# Altium schematic sheet modFOC-MCU.SchDoc
size A4
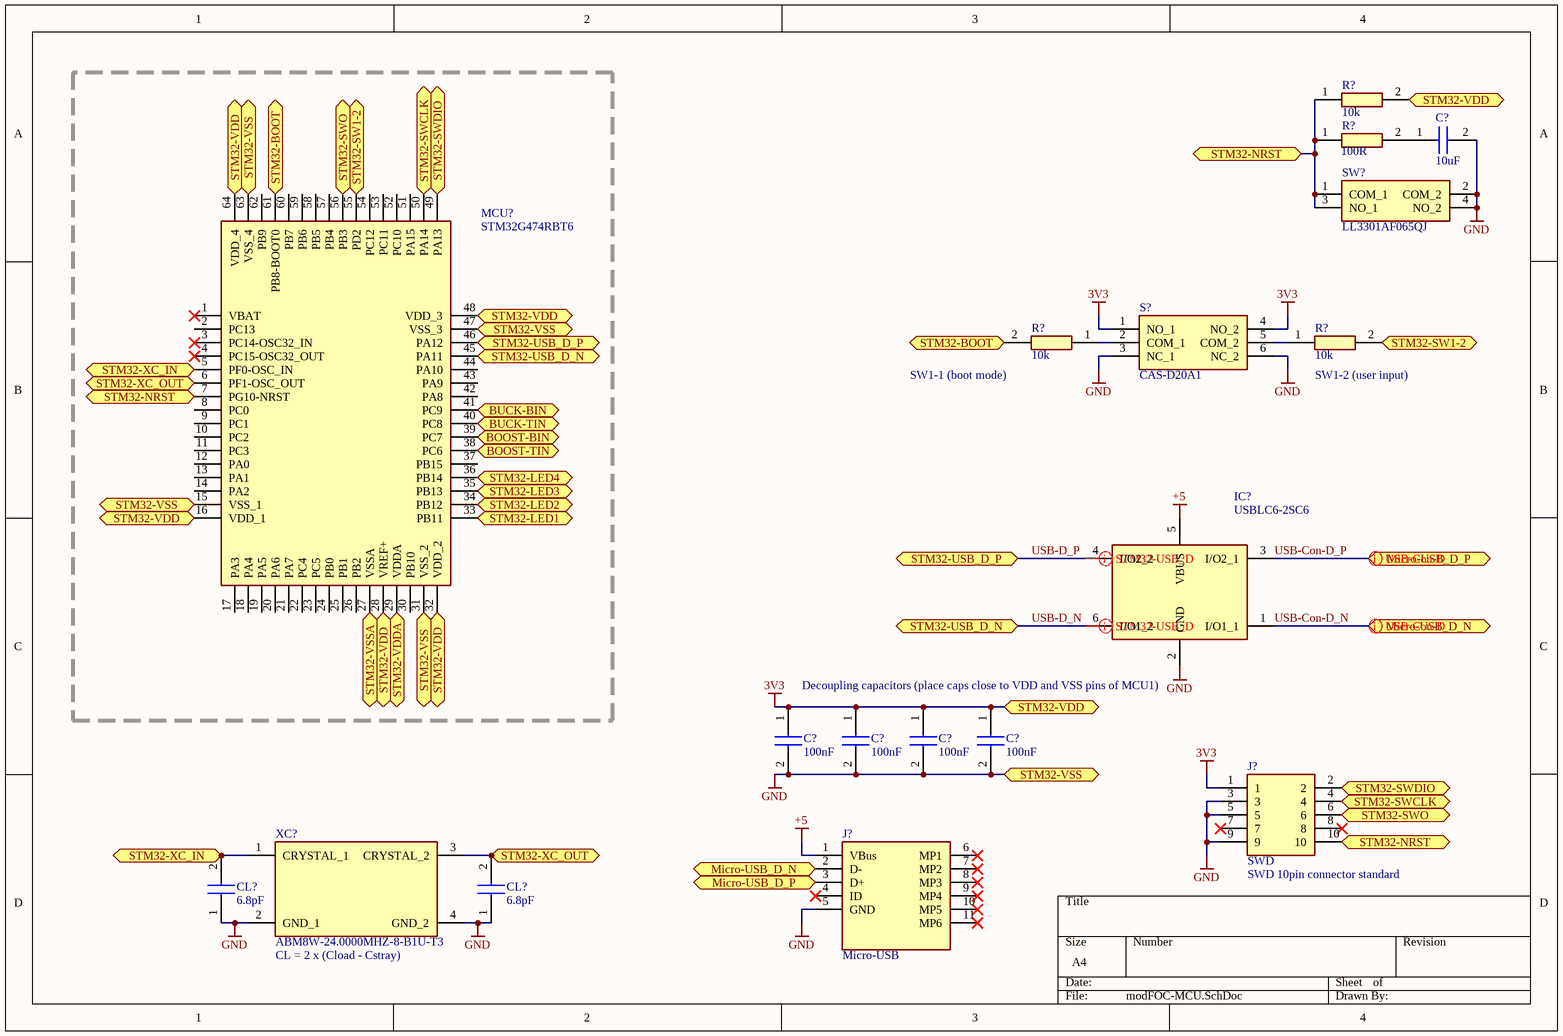
[diagram p0: modFOC-MCU.SchDoc]

## Parts
(Parts that share a designator on the sheet are numbered #1, #2 ... from top to bottom, then left to right.)
C?#1  10uF  [CAPC3225X280N]
C?#2  100nF  [CAPC1608X97N]
C?#3  100nF  [CAPC1608X97N]
C?#4  100nF  [CAPC1608X97N]
C?#5  100nF  [CAPC1608X97N]
CL?#1  6.8pF  [CAPC1608X87N]
CL?#2  6.8pF  [CAPC1608X87N]
IC?  USBLC6-2SC6  [SOT95P280X145-6N]
J?#1  SWD  [HUSSP10W40P127_2X5_635X340X420P]
J?#2  Micro-USB  [19815841]
MCU?  STM32G474RBT6  [QFP50P1200X1200X160-64N]
R?#1  10k  [RESC1608X55N]
R?#2  100R  [RESC1608X55N]
R?#3  10k  [RESC1608X55N]
R?#4  10k  [RESC1608X55N]
S?  CAS-D20A1  [CASD20A1]
SW?  LL3301AF065QJ  [LL3301FF065QJ]
XC?  ABM8W-24.0000MHZ-8-B1U-T3  [ABM8W240000MHZ8B1UT3]

## Ports
BOOST-BIN (bidir), BOOST-TIN (bidir), BUCK-BIN (bidir), BUCK-TIN (bidir), Micro-USB_D_N (bidir), Micro-USB_D_P (bidir), STM32-BOOT (bidir), STM32-LED1 (bidir), STM32-LED2 (bidir), STM32-LED3 (bidir), STM32-LED4 (bidir), STM32-NRST (bidir), STM32-SW1-2 (bidir), STM32-SWCLK (bidir), STM32-SWDIO (bidir), STM32-SWO (bidir), STM32-USB_D_N (bidir), STM32-USB_D_P (bidir), STM32-VDD (bidir), STM32-VDDA (bidir), STM32-VSS (bidir), STM32-VSSA (bidir), STM32-XC_IN (bidir), STM32-XC_OUT (bidir)

## Nets
3V3: C?#2.1 C?#3.1 C?#4.1 C?#5.1 J?#1.1 MCU?.16(VDD_1) MCU?.28(VREF+) MCU?.32(VDD_2) MCU?.48(VDD_3) MCU?.64(VDD_4) R?#1.2 S?.1(NO_1) S?.4(NO_2) ; port STM32-VDD
+5: IC?.5(VBUS) J?#2.1(VBus)
GND: C?#1.2 C?#2.2 C?#3.2 C?#4.2 C?#5.2 CL?#1.1 CL?#2.1 IC?.2(GND) J?#1.3 J?#1.5 J?#1.9 J?#2.5(GND) MCU?.15(VSS_1) MCU?.31(VSS_2) MCU?.47(VSS_3) MCU?.63(VSS_4) S?.3(NC_1) S?.6(NC_2) SW?.2(COM_2) SW?.4(NO_2) XC?.2(GND_1) XC?.4(GND_2) ; port STM32-VSS
BOOST-BIN: MCU?.39(PC7) ; port BOOST-BIN
BOOST-TIN: MCU?.38(PC6) ; port BOOST-TIN
BUCK-BIN: MCU?.41(PC9) ; port BUCK-BIN
BUCK-TIN: MCU?.40(PC8) ; port BUCK-TIN
STM32-BOOT: MCU?.61(PB8-BOOT0) R?#3.2 ; port STM32-BOOT
STM32-LED1: MCU?.33(PB11) ; port STM32-LED1
STM32-LED2: MCU?.34(PB12) ; port STM32-LED2
STM32-LED3: MCU?.35(PB13) ; port STM32-LED3
STM32-LED4: MCU?.36(PB14) ; port STM32-LED4
STM32-NRST: J?#1.10 MCU?.7(PG10-NRST) R?#1.1 R?#2.1 SW?.1(COM_1) SW?.3(NO_1) ; port STM32-NRST
STM32-SW1-2: MCU?.55(PD2) R?#4.2 ; port STM32-SW1-2
STM32-SWCLK: J?#1.4 MCU?.50(PA14) ; port STM32-SWCLK
STM32-SWDIO: J?#1.2 MCU?.49(PA13) ; port STM32-SWDIO
STM32-SWO: J?#1.6 MCU?.56(PB3) ; port STM32-SWO
STM32-VDDA: MCU?.29(VDDA) ; port STM32-VDDA
STM32-VSSA: MCU?.27(VSSA) ; port STM32-VSSA
STM32-XC_IN: CL?#1.2 MCU?.5(PF0-OSC_IN) XC?.1(CRYSTAL_1) ; port STM32-XC_IN
STM32-XC_OUT: CL?#2.2 MCU?.6(PF1-OSC_OUT) XC?.3(CRYSTAL_2) ; port STM32-XC_OUT
USB-Con-D_N: IC?.1(I/O1_1) J?#2.2(D-) ; port Micro-USB_D_N
USB-Con-D_P: IC?.3(I/O2_1) J?#2.3(D+) ; port Micro-USB_D_P
USB-D_N: IC?.6(I/O1_2) MCU?.45(PA11) ; port STM32-USB_D_N
USB-D_P: IC?.4(I/O2_2) MCU?.46(PA12) ; port STM32-USB_D_P
NetC?#1_1: C?#1.1 R?#2.2
NetR?#3_1: R?#3.1 S?.2(COM_1)
NetR?#4_1: R?#4.1 S?.5(COM_2)

Not connected (* = marked no-connect by the designer): J?#1 7* 8*; J?#2 4(ID)* 6(MP1)* 7(MP2)* 8(MP3)* 9(MP4)* 10(MP5)* 11(MP6)*; MCU? 1(VBAT)* 2(PC13) 3(PC14-OSC32_IN)* 4(PC15-OSC32_OUT)* 8(PC0) 9(PC1) 10(PC2) 11(PC3) 12(PA0) 13(PA1) 14(PA2) 17(PA3) 18(PA4) 19(PA5) 20(PA6) 21(PA7) 22(PC4) 23(PC5) 24(PB0) 25(PB1) 26(PB2) 30(PB10) 37(PB15) 42(PA8) 43(PA9) 44(PA10) 51(PA15) 52(PC10) 53(PC11) 54(PC12) 57(PB4) 58(PB5) 59(PB6) 60(PB7) 62(PB9)

## Layout directives
differential pair; rule Differential Pairs Routing [Pref Gap = 0.178mm    Min Gap  = 0.1mm    Max Gap  = 0.254mmPref Width = 0.247mm    Min Width  = 0.1mm    Max Width  = 0.381mm]: USB-Con-D_N, USB-D_P
differential pair: USB-Con-D_P, USB-D_N

## Notes on the sheet
- (near R?#3) SW1-1 (boot mode)
- (near R?#4) SW1-2 (user input)
- (near C?#3) Decoupling capacitors (place caps close to VDD and VSS pins of MCU1)
- (near J?#1) SWD 10pin connector standard
- (near XC?) CL = 2 x (Cload - Cstray)

## Library data of the parts
C?#1 = CL32B106KMVNNWE: Capacitor; Manufacturer_Name: Samsung Electro-Mechanics; Datasheet Link: https://www.arrow.com/en/products/cl32b106kmvnnwe/samsung-electro-mechanics; Height: 2.8mm; Manufacturer_Part_Number: CL32B106KMVNNWE; Arrow Part Number: CL32B106KMVNNWE; Arrow Price/Stock: https://www.arrow.com/en/products/cl32b106kmvnnwe/samsung-electro-mechanics; Mouser Part Number: 187-CL32B106KMVNNWE; Mouser Price/Stock: https://www.mouser.co.uk/ProductDetail/Samsung-Electro-Mechanics/CL32B106KMVNNWE?qs=xZ%2FP%252Ba9zWqaEMBbSgKy8gQ%3D%3D
C?#2-C?#5 = VJ0603Y104JXJAC: Capacitor; Manufacturer_Name: Vishay; Datasheet Link: http://www.vishay.com/docs/45226/vj31xrohsautomlcc.pdf; Height: 0.97mm; Manufacturer_Part_Number: VJ0603Y104JXJAC; Mouser Part Number: 77-VJ0603Y104JXJAC; Mouser Price/Stock: https://www.mouser.com/Search/Refine.aspx?Keyword=77-VJ0603Y104JXJAC
CL?#1 CL?#2 = C0603C689C5GACTU: Capacitor; Manufacturer_Name: Kemet; Datasheet Link: http://docs-emea.rs-online.com/webdocs/116e/0900766b8116eaf8.pdf; Height: 0.87mm; Manufacturer_Part_Number: C0603C689C5GACTU; Arrow Part Number: C0603C689C5GACTU; Arrow Price/Stock: https://www.arrow.com/en/products/c0603c689c5gactu/kemet-corporation; Mouser Part Number: 80-C0603C689C5G; Mouser Price/Stock: https://www.mouser.com/Search/Refine.aspx?Keyword=80-C0603C689C5G
IC? = USBLC6-2SC6: Integrated Circuit; Manufacturer_Name: STMicroelectronics; Datasheet Link: http://www.st.com/st-web-ui/static/active/en/resource/technical/document/datasheet/CD00050750.pdf; Height: 1.45mm; Manufacturer_Part_Number: USBLC6-2SC6; Arrow Part Number: USBLC6-2SC6; Arrow Price/Stock: https://www.arrow.com/en/products/usblc6-2sc6/stmicroelectronics; Mouser Part Number: 511-USBLC6-2SC6; Mouser Price/Stock: https://www.mouser.co.uk/ProductDetail/STMicroelectronics/USBLC6-2SC6?qs=po45yt2pPpu%2FhNIlwQdTlg%3D%3D
J?#1 = M50-3600542R: Connector; Manufacturer_Name: Harwin; Datasheet Link: https://cdn.harwin.com/pdfs/M50-360R.pdf; Manufacturer_Part_Number: M50-3600542R; Mouser Part Number: 855-M50-3600542R; Mouser Price/Stock: https://www.mouser.co.uk/ProductDetail/Harwin/M50-3600542R?qs=DVxm2sPGGrrPu%2FxuhpV3yw%3D%3D
J?#2 = 1981584-1: Connector; Manufacturer_Name: TE Connectivity; Datasheet Link: http://www.te.com/commerce/DocumentDelivery/DDEController?Action=showdoc&DocId=Customer+Drawing%7F1981584%7FD2%7Fpdf%7FEnglish%7FENG_CD_1981584_D2.pdf%7F1981584-1; Height: 3mm; Manufacturer_Part_Number: 1981584-1; Arrow Part Number: 1981584-1; Arrow Price/Stock: https://www.arrow.com/en/products/1981584-1/te-connectivity; Mouser Part Number: 571-1981584-1; Mouser Price/Stock: https://www.mouser.co.uk/ProductDetail/TE-Connectivity/1981584-1?qs=ozkTL%2FUej0TLYxjQLPnd2Q%3D%3D
MCU? = STM32G474RBT6: Integrated Circuit; Manufacturer_Name: STMicroelectronics; Datasheet Link: https://www.mouser.com/datasheet/2/389/stm32g474cb-1600828.pdf; Height: 1.6mm; Manufacturer_Part_Number: STM32G474RBT6; Mouser Part Number: 511-STM32G474RBT6; Mouser Price/Stock: https://www.mouser.co.uk/ProductDetail/STMicroelectronics/STM32G474RBT6?qs=uwxL4vQweFP0uAZUZXLBhQ%3D%3D
R?#1 = RC0603FR-0710KL: Resistor; Manufacturer_Name: YAGEO (PHYCOMP); Datasheet Link: http://www.yageo.com/documents/recent/PYu-RC0603_51_RoHS_L_v5.pdf; Height: 0.55mm; Manufacturer_Part_Number: RC0603FR-0710KL; Arrow Part Number: RC0603FR-0710KL; Arrow Price/Stock: https://www.arrow.com/en/products/rc0603fr-0710kl/yageo; Mouser Part Number: 603-RC0603FR-0710KL; Mouser Price/Stock: https://www.mouser.co.uk/ProductDetail/Yageo/RC0603FR-0710KL?qs=grNVn54RoB%252B3GtjbJj3wJQ%3D%3D
R?#2 = CRCW0603100RFKEAC: Resistor; Manufacturer_Name: Vishay; Datasheet Link: https://componentsearchengine.com/Datasheets/1/CRCW0603100RFKEAC.pdf; Height: 0.55mm; Manufacturer_Part_Number: CRCW0603100RFKEAC; Mouser Part Number: 71-CRCW0603100RFKEAC; Mouser Price/Stock: https://www.mouser.co.uk/ProductDetail/Vishay-Dale/CRCW0603100RFKEAC/?qs=E3Y5ESvWgWPJqb4%2F19sAKw%3D%3D; Arrow Part Number: CRCW0603100RFKEAC; Arrow Price/Stock: https://www.arrow.com/en/products/crcw0603100rfkeac/vishay
R?#3 R?#4 = MCT06030C1002FP500: Resistor; Manufacturer_Name: Vishay; Datasheet Link: http://www.vishay.com/docs/28705/mcx0x0xpro.pdf; Height: 0.55mm; Manufacturer_Part_Number: MCT06030C1002FP500; Mouser Part Number: 594-MCT06030C1002FP5; Mouser Price/Stock: https://www.mouser.co.uk/ProductDetail/Vishay-Beyschlag/MCT06030C1002FP500?qs=Wvg1umJc15zoHgIjwqoGHw%3D%3D
S? = CAS-D20A1: Switch; Manufacturer_Name: Copal Electronics; Datasheet Link: https://www.nidec-copal-electronics.com/e/catalog/switch/cas.pdf; Height: 2.5mm; Manufacturer_Part_Number: CAS-D20A1
SW? = LL3301AF065QJ: Switch; Manufacturer_Name: E-Switch; Datasheet Link: https://media.digikey.com/pdf/Data%20Sheets/E-Switch%20PDFs/LL3301AF065QJ.pdf; Height: 7.3mm; Manufacturer_Part_Number: LL3301AF065QJ; Mouser Part Number: 612-LL3301AF065QJ; Mouser Price/Stock: https://www.mouser.co.uk/ProductDetail/E-Switch/LL3301AF065QJ?qs=QtyuwXswaQi68RkbBY57jQ%3D%3D
XC? = ABM8W-24.0000MHZ-8-B1U-T3: Crystal or Oscillator; Manufacturer_Name: ABRACON; Datasheet Link: https://www.mouser.com/datasheet/2/3/ABM8W-1107617.pdf; Height: 0.75mm; Manufacturer_Part_Number: ABM8W-24.0000MHZ-8-B1U-T3; Arrow Part Number: ABM8W-24.0000MHZ-8-B1U-T3; Arrow Price/Stock: https://www.arrow.com/en/products/abm8w-24.0000mhz-8-b1u-t3/abracon; Mouser Part Number: 815-8W24-8B1UT; Mouser Price/Stock: https://www.mouser.com/Search/Refine.aspx?Keyword=815-8W24-8B1UT